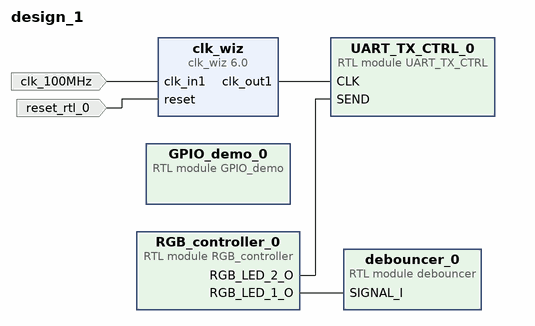
[diagram p0: block diagram of the top level]
# Vivado block design design_1, xc7a100tcsg324-1, Vivado 2019.2
create_bd_design design_1

create_bd_port -dir I -type clk clk_100MHz
set_property -dict {CONFIG.FREQ_HZ 100000000} [get_bd_ports clk_100MHz]
create_bd_port -dir I -type rst reset_rtl_0
set_property -dict {CONFIG.POLARITY ACTIVE_HIGH} [get_bd_ports reset_rtl_0]

create_bd_cell -type module -reference UART_TX_CTRL UART_TX_CTRL_0
create_bd_cell -type module -reference RGB_controller RGB_controller_0
create_bd_cell -type ip -vlnv xilinx.com:ip:clk_wiz:6.0 clk_wiz
create_bd_cell -type module -reference debouncer debouncer_0
create_bd_cell -type module -reference GPIO_demo GPIO_demo_0

# ---- connections ----

connect_bd_net [get_bd_pins clk_wiz/clk_out1] [get_bd_pins UART_TX_CTRL_0/CLK]
connect_bd_net [get_bd_ports clk_100MHz] [get_bd_pins clk_wiz/clk_in1]
connect_bd_net -net reset_rtl_0_1 [get_bd_ports reset_rtl_0] [get_bd_pins clk_wiz/reset]
connect_bd_net [get_bd_pins RGB_controller_0/RGB_LED_1_O] [get_bd_pins debouncer_0/SIGNAL_I]
connect_bd_net [get_bd_pins RGB_controller_0/RGB_LED_2_O] [get_bd_pins UART_TX_CTRL_0/SEND]

validate_bd_design
save_bd_design
